# EAGLE design femtoduinoUSB (EAGLE 6.4)
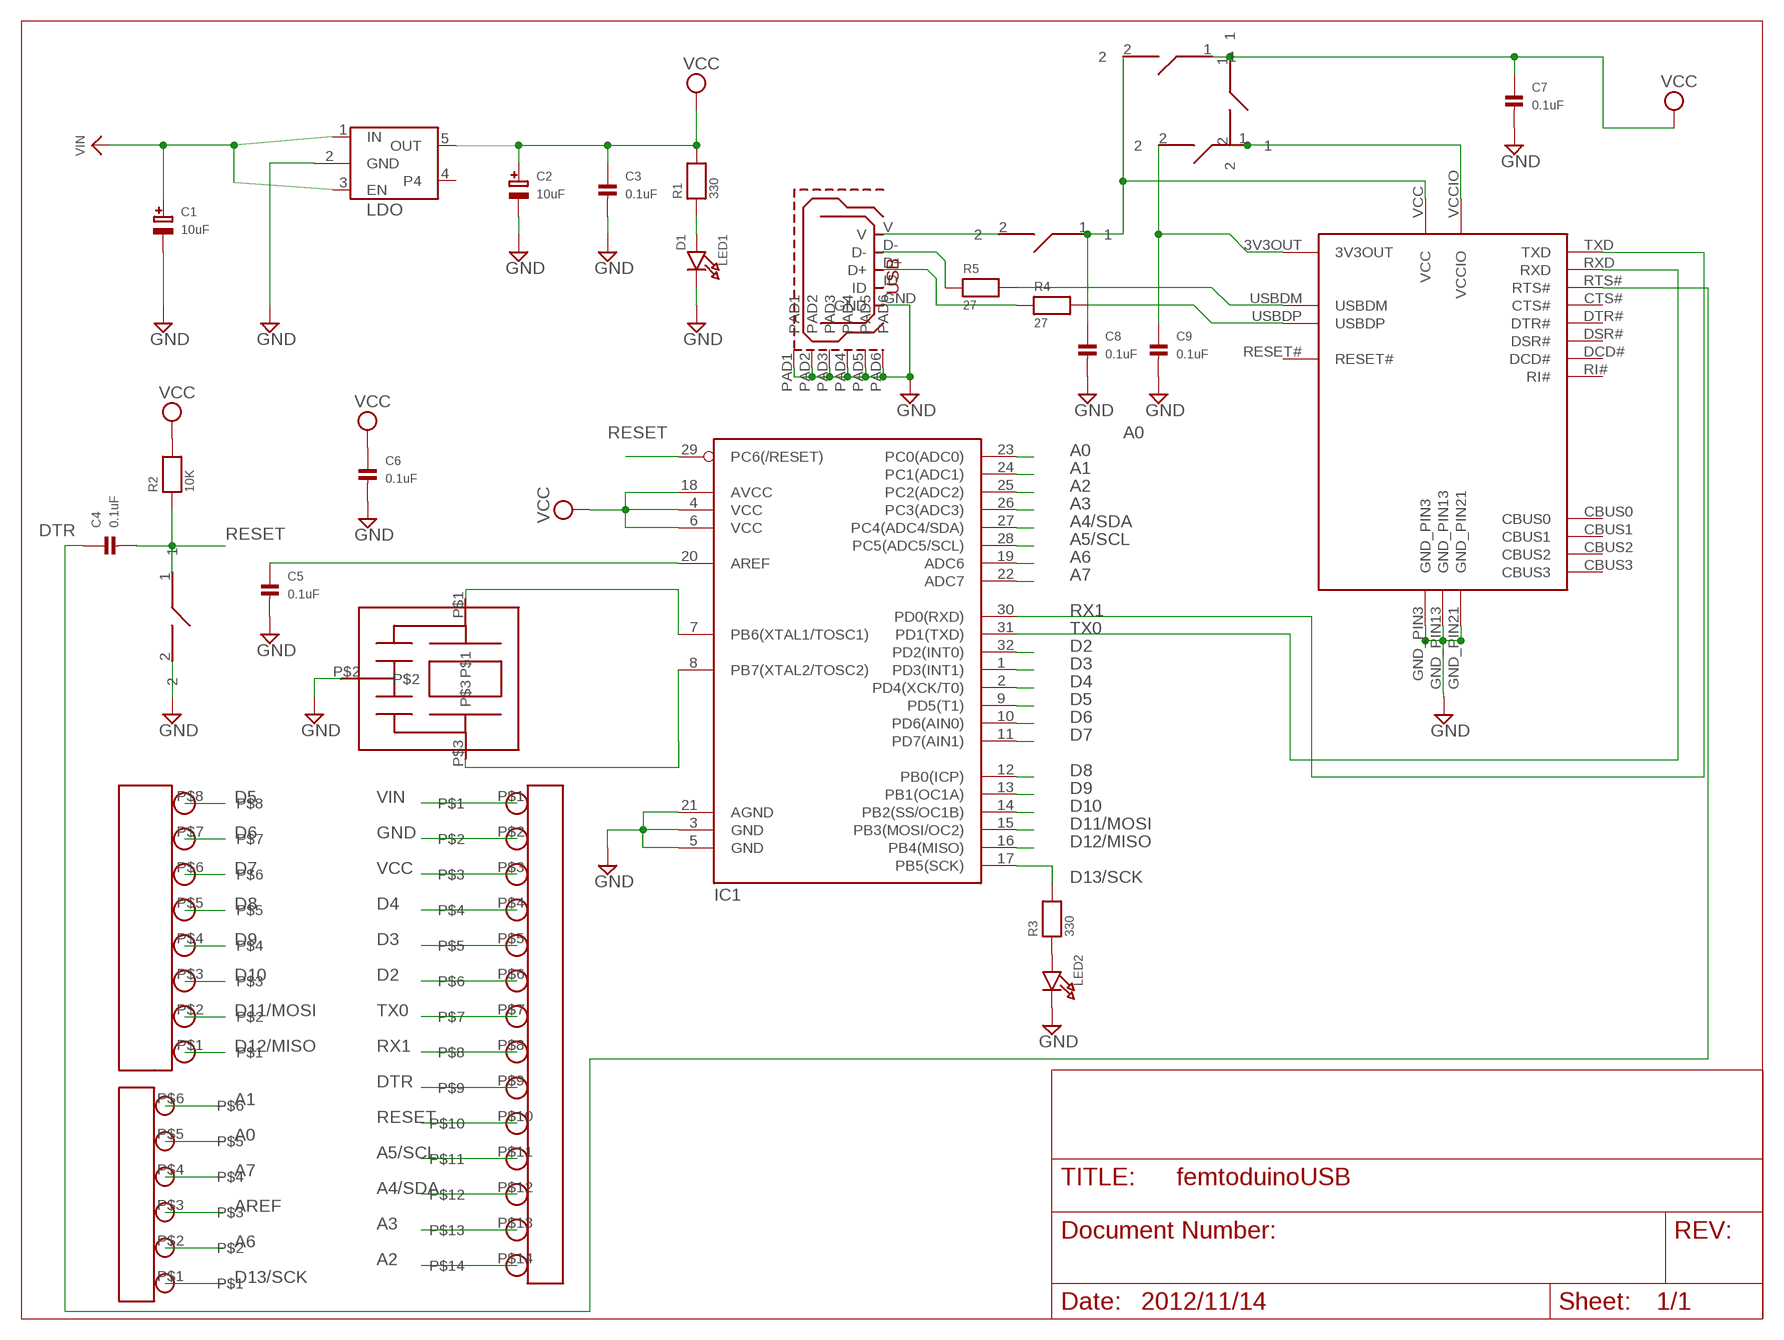
[diagram p0: schematic, sheet 1]
FRAME1 (LETTER_L): LAST_DATE_TIME: 2012/11/14

## Parts
C1  10uF  CAP_TANTALUMB/3528_WAVE  [EIA3528-21/B-W]
C2  10uF  CAP_TANTALUMB/3528_WAVE  [EIA3528-21/B-W]
C3  0.1uF  CAP_CERAMIC0402  [0402]
C4  0.1uF  CAP_CERAMIC0402  [0402]
C5  0.1uF  CAP_CERAMIC0402  [0402]
C6  0.1uF  CAP_CERAMIC0402  [0402]
C7  0.1uF  CAP_CERAMIC0402  [0402]
C8  0.1uF  CAP_CERAMIC0402  [0402]
C9  0.1uF  CAP_CERAMIC0402  [0402]
IC1  ATMEGA168MLF  [MLF32]
IC2  FT231XQ-R  [FTDI_FT231XQ-R_PACKAGE]
LED1  D1  LED0805  [CHIPLED_0805]
LED2  LED0805  [CHIPLED_0805]
R1  330  RESISTOR0402  [0402]
R2  10K  RESISTOR0402  [0402]
R3  330  RESISTOR0402  [0402]
R4  27  RESISTOR0402  [0402]
R5  27  RESISTOR0402  [0402]
SJ1  SPST_SMD  [SPST_SMD]
SJ2  SPST_SMD  [SPST_SMD]
SJ3  SPST_SMD  [SPST_SMD]
SJ4  SPST_SMD  [SPST_SMD]
U1  MIC5205  LDO_REGULATOR  [LDO_REGULATOR]
U$2  05_PINHEAD_1X6  [05_PINHEAD_1X6_PACKAGE]
U$3  05_PINHEAD_1X8  [05_PINHEAD_1X8_PACKAGE]
U$4  05_PINHEAD_1X14  [05_PINHEAD_1X14_PACKAGE]
U$5  CSTCE16MOV51-RO  [CSTCE16M0V51-RO_PACKAGE]
U$6  SPST_SMD  [SPST_SMD]
USB1  USB_MICROB  [USB_MICROB_PACKAGE]

## Nets
A0: IC1.23(PC0(ADC0)) U$2.P$5
A1: IC1.24(PC1(ADC1)) U$2.P$6
A2: IC1.25(PC2(ADC2)) U$4.P$14
A3: IC1.26(PC3(ADC3)) U$4.P$13
A4/SDA: IC1.27(PC4(ADC4/SDA)) U$4.P$12
A5/SCL: IC1.28(PC5(ADC5/SCL)) U$4.P$11
A6: IC1.19(ADC6) U$2.P$2
A7: IC1.22(ADC7) U$2.P$4
AREF: C5.1 IC1.20(AREF) U$2.P$3
D2: IC1.32(PD2(INT0)) U$4.P$6
D3: IC1.1(PD3(INT1)) U$4.P$5
D4: IC1.2(PD4(XCK/T0)) U$4.P$4
D5: IC1.9(PD5(T1)) U$3.P$8
D6: IC1.10(PD6(AIN0)) U$3.P$7
D7: IC1.11(PD7(AIN1)) U$3.P$6
D8: IC1.12(PB0(ICP)) U$3.P$5
D9: IC1.13(PB1(OC1A)) U$3.P$4
D10: IC1.14(PB2(SS/OC1B)) U$3.P$3
D11/MOSI: IC1.15(PB3(MOSI/OC2)) U$3.P$2
D12/MISO: IC1.16(PB4(MISO)) U$3.P$1
D13/SCK: IC1.17(PB5(SCK)) R3.2 U$2.P$1
DTR: C4.1 IC2.RTS# U$4.P$9
GND: C1.- C2.- C3.2 C5.2 C6.2 C7.2 C8.2 C9.2 IC1.3(GND) IC1.5(GND) IC1.21(AGND) IC2.GND_PIN3 IC2.GND_PIN13 IC2.GND_PIN21 LED1.C LED2.C U1.2(GND) U$4.P$2 U$5.P$2 U$6.2 USB1.GND USB1.PAD1 USB1.PAD2 USB1.PAD3 USB1.PAD4 USB1.PAD5 USB1.PAD6
N$1: R4.1 USB1.D+
N$2: R5.1 USB1.D-
N$4: C8.1 IC2.VCC SJ1.1 SJ2.2
N$5: LED1.A R1.1
N$6: IC2.USBDM R5.2
N$7: IC2.USBDP R4.2
N$8: C9.1 IC2.3V3OUT SJ4.2
N$9: IC2.VCCIO SJ3.2 SJ4.1
N$25: LED2.A R3.1
PB6: IC1.7(PB6(XTAL1/TOSC1)) U$5.P$1
PB7: IC1.8(PB7(XTAL2/TOSC2)) U$5.P$3
RESET: C4.2 IC1.29(PC6(/RESET)) R2.1 U$4.P$10 U$6.1
RX1: IC1.30(PD0(RXD)) IC2.TXD U$4.P$8
TX0: IC1.31(PD1(TXD)) IC2.RXD U$4.P$7
VCC: C2.+ C3.1 C6.1 C7.1 IC1.4(VCC) IC1.6(VCC) IC1.18(AVCC) R1.2 R2.2 SJ1.2 SJ2.1 SJ3.1 U1.5(OUT) U$4.P$3 USB1.V
VIN: C1.+ U1.1(IN) U1.3(EN) U$4.P$1
Unconnected: IC2.CBUS0 IC2.CBUS1 IC2.CBUS2 IC2.CBUS3 IC2.CTS# IC2.DCD# IC2.DSR# IC2.DTR# IC2.RESET# IC2.RI# U1.4 USB1.ID

## Library data of the parts
C1 C2 = microbuilder:CAP_TANTALUM: Tantalum Capacitors Wave footprints have larger pads and are meant to be used for hand soldering. Reflow footprints are optimised for solder paste and a reflow oven. EIA3216-18/A-[R/W] - Size A / 3216-18 / 1206 footprint 4.7µF 25V 10% Tantalum Capacitor 10µF 16V 10% Tantalum Capacitor [Digikey: 495-2236-2-ND] EIA3528-21/B-[R/W] - Size B / 3528-21 47µF 10V 10% Tantalum Capactior [Digikey: 495-2216-1-ND] EIA6032-28/C-[R/W] - Size C / 6032-28 10µF 35V 20% Tantalum Capacitor [Digikey: 495-2285-1-ND] 100µF 16V 10% Tantalum Capactior [Digikey: 399-5214-1-ND]
C3-C9 = microbuilder:CAP_CERAMIC: Ceramic Capacitors 0402 - 0402 Surface Mount Capacitors 16pF 50V 5% [Digikey: 445-4899-2-ND] 18pF 50V 5% [Digikey: 490-1281-2-ND] 22pF 50V 5% [Digikey: 490-1283-2-ND] 68pF 50V 5% [Digikey: 490-1289-2-ND] 0.1uF 10V 10% [Digikey: 490-1318-2-ND] 1.0uF 6.3V 10% [Digikey: 490-1320-2-ND] 0603 - 0603 Surface Mount Capacitors 16 pF 50V 5% [Digikey: 445-5051-2-ND] 22 pF 50V [Digikey: PCC220ACVTR-ND] 33 pF 50V 5% [Digikey: 490-1415-1-ND] 56pF 50V 5% [Digikey: 490-1421-1-ND] 220pF 50V 5% [Digikey: 445-1285-1-ND] 680 pF 50V 2200 pF 50V 5% C0G [Digikey: 445-1297-1-ND] 5600 pF 100V 5% X7R [Digikey: 478-3711-1-ND] 0.1 µF 25V 10% [Digikey: PCC2277TR-ND] 0.22 µF 16V 10% X7R [Digikey: 445-1318-1-ND] 1.0 µF 25V 10% [Digikey: 445-5146-2-ND] 0603 - RF Specific 3pF 250V +/-0.1pF RF [Digikey: 712-1347-1-ND] 18 pF 250V 5% [Digikey: 478-3505-1-ND or 712-1322-1-ND] 56 pF 250V 5% C0G RF [Digikey: 490-4867-1-ND] 68 pF 250V RF [Digikey: 490-4868-1-ND] 0805 - 0805 Surface Mount Capacitors 220 pF 250V 2% RF Ceramic Capacitor [Digikey: 712-1398-1-ND] 1000 pF 50V 2% NP0 Ceramic Capacitor [Digikey: 478-3760-1-ND] 0.1 µF 25V 10% Ceramic Capacitor [Digikey: PCC1828TR-ND] 1.0 µF 16V 10% Ceramic Capacitor[Digikey: 490-1691-2-ND] 10.0 µF 10V 10% Ceramic Capacitor[Digikey: 709-1228-1-ND] 10.0 uF 16V 10% Ceramic Capacitor [Digikey: 478-5165-2-ND] 47 uF 6.3V 20% Ceramic Capacitor [Digikey: 587-1779-1-ND or 399-5506-1-ND] 1206 - 1206 Surface Mount Capacitors 47uF 10V 20% Ceramic Capacitor [Digikey: 490-5528-1-ND or 399-5508-1-ND or 445-6010-1-ND] 100uF 6.3V -20%, +80% Y5V Ceramic Capacitor (Digikey: 490-4512-1-ND, Mouser: 81-GRM31CF50J107ZE1L)
IC1 = SparkFun-DigitalIC:ATMEGA168: Atmel 32-pin 8-bit micro, 16k flash.
IC2 = ftdi_ft231xq-r:FT231XQ-R: This is the 20-LD QFN package of the FTDI FT231XQ-R chip.
LED1 LED2 = microbuilder:LED: LED 0603 - 0603 Surface Mount Package 2mA: Green LED - Low Power (3.9mcd, 2ma, 1.7Vf) - Digikey: 475-2709-2-ND Orange LED - Low Power (9.8mcd, 2ma, 1.8Vf) - Digikey: 475-1194-2-ND Red LED - Low Power (5mcd, 2ma, 1.8Vf) - Digikey: 475-1195-2-ND Yellow LED - Low Power (7mcd, 2ma, 1.8Vf) - Digikey: 475-1196-2-ND 5mA: Blue LED - Low Power (17mcd, 5ma, 2.9Vf) - Digikey: LNJ937W8CRACT-ND 0805 - 0805 Surface Mount Package 2mA: Red LED (8.8mcd, 2mA, 1.8Vf, Clear) - Low Power [Digikey: 475-2510-1-ND] Green LED (5mcd, 2mA, 1.8Vf, Clear) - Low Power [Digikey: 475-2730-1-ND] Yellow LED (11.3mcd, 2mA, 1.8Vf, Clear) - Low Power [Digikey: 475-2555-1-ND] 20mA: Red LED (104mcd, 20mA, Diffused) - LS R976 [Digikey: 475-1278-6-ND] Red LED (12mcd, 20mA, 2.0Vf, Clear) - APT2012EC [Digikey: 754-1128-1-ND] Green LED (15mcd, 20mA, 2.2Vf, Clear) - APT2012GC [Digikey: 754-1131-1-ND] Orange LED (160mcd, 20mA, 2.1Vf, Clear) - APT2012SECK [Digikey: 754-1130-1-ND] 1206 - 1206 Surface Mount Package Green LED (26mcd, 20mA, Diffused) - LG N971 [Digikey: 475-1407-6-ND] Red LED (15mcd, 20mA, Diffused) - LH N974 [Digikey: 475-1416-6-ND]
R1-R5 = microbuilder:RESISTOR: Resistors 0402 - 0402 Surface Mount Package 22 Ohm 1% 1/16W [Digikey: 311-22.0LRTR-ND] 33 Ohm 5% 1/16W 1.0K 5% 1/16W 1.5K 5% 1/16W 2.0K 1% 1/16W 10.0K 1% 1/16W [Digikey: 311-10.0KLRTR-ND] 10.0K 5% 1/16W [Digikey: RMCF0402JT10K0TR-ND] 12.1K 1% 1/16W [Digikey: 311-22.0LRTR-ND] 100.0K 5% 1/16W 0603 - 0603 Surface Mount Package 0 Ohm 1/10 Watt 1% Resistor 15 Ohm 1/10 Watt 1% Resistor 33 Ohm 1/10 Watt 1% Resistor 49.9 Ohm 1/10 Watt 1% Resistor 100 Ohm 1/10 Watt 1% Resistor 150 Ohm 1/10 Watt 1% Resistor 240 Ohm 1/10 Watt 1% Resistor 390 Ohm 1/10 Watt 1% Resistor 560 Ohm 1/10 Watt 1% Resistor 680 Ohm 1/10 Watt 1% Resistor 750 Ohm 1/10 Watt 1% Resistor 1.0K Ohm 1/10 Watt 1% Resistor 1.5K Ohm 1/10 Watt 1% Resistor 2.0K Ohm 1/10 Watt 1% Resistor 2.2K Ohm 1/10 Watt 1% Resistor 3.3K Ohm 1/10 Watt 1% Resistor 4.7K Ohm 1/10 Watt 1% Resistor 10.0K Ohm 1/10 Watt 1% Resistor 12.0K Ohm 1/10 Watt 1% Resistor 12.1K Ohm 1/10 Watt 1% Resistor 20.0K Ohm 1/10 Watt 1% Resistor 33.0K Ohm 1/10 Watt 1% Resistor 100.0K Ohm 1/10 Watt 1% Resistor 0805 - 0805 Surface Mount Package 0 Ohm 1/8 Watt 1% Resistor 33 Ohm 1/8 Watt 1% Resistor 100 Ohm 1/8 Watt 1% Resistor 150 Ohm 1/8 Watt 1% Resistor 200 Ohm 1/8 Watt 1% Resistor 240 Ohm 1/8 Watt 1% Resistor 330 Ohm 1/8 Watt 1% Resistor 390 Ohm 1/8 Watt 1% Resistor 470 Ohm 1/8 Watt 1% Resistor 1.0K Ohm 1/8 Watt 1% Resistor 1.5K Ohm 1/8 Watt 1% Resistor 2.0K Ohm 1/8 Watt 1% Resistor 4.7K Ohm 1/8 Watt 1% Resistor 5.1K Ohm 1/8 Watt 1% Resistor 5.6K Ohm 1/8 Watt 1% Resistor 10.0K Ohm 1/8 Watt 1% Resistor 22.0K Ohm 1/8 Watt 1% Resistor 33.0K Ohm 1/8 Watt 1% Resistor 100K Ohm 1/8 Watt 1% Resistor 1206 - 1206 Surface Mount Package 2012 - 2010 Surface Mount Package 0.11 Ohm 1/2 Watt 1% Resistor - Digikey: RHM.11UCT-ND
SJ1-SJ4 U$6 = ftdi_ft231xq-r:SPST_SMD
U1 = ftdi_ft231xq-r:LDO_REGULATOR
U$2 = ftdi_ft231xq-r:05_PINHEAD_1X6
U$3 = ftdi_ft231xq-r:05_PINHEAD_1X8
U$4 = ftdi_ft231xq-r:05_PINHEAD_1X14
U$5 = ftdi_ft231xq-r:CSTCE16MOV51-RO: This is the CSTCE16M0V51-R0 Murata resonator (CERALOCK) 16Mhz 0.5% Tolerance
USB1 = ftdi_ft231xq-r:USB_MICROB: This is the hirose ZX62-B-5PA(11) MICRO-USB B Type female connection.

## Board
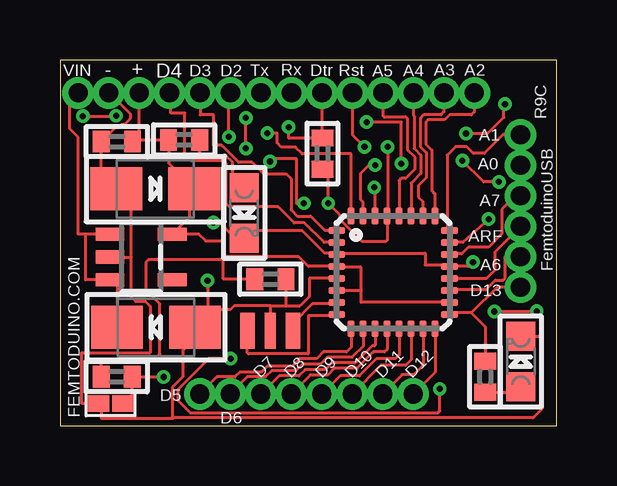
[diagram p1: board, top side]
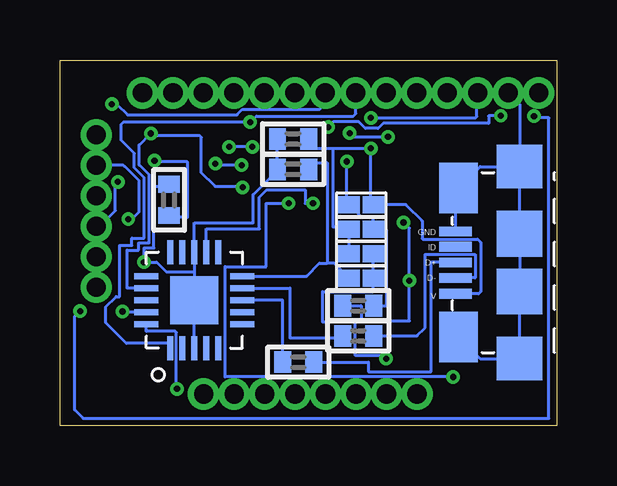
[diagram p2: board, bottom side, seen from below]

Size 20.7 x 15.24 mm. Coordinates in mm from the lower left corner, seen from the top.
Outline: 0,0 20.7,0 20.7,15.24 0,15.24 0,0
Copper layers (1*16): Top 0.035mm / dielectric 1.5mm / Bottom 0.035mm
Design rules "Fusion_eagle_rule_v1.1": minimum track width 6mil, minimum drill 12mil, track to track 6mil, track to pad 6mil, pad to pad 6mil, via to via 6mil, smd to smd 0mil, copper to edge 10mil, drill to drill 10mil, minimum pad ring 10mil, minimum via ring 6mil, stop-mask expansion 2mil, vias tented up to drill 100mil, thermal gap 10mil

### Footprints (pad centres in the part's own frame; a part is rotated, then mirrored left to right if it is on the bottom)
EIA3528-21/B-W = smd 2.15 x 1.8: + 1.625,0; - -1.625,0
0402 = smd 0.7 x 0.9: 1 -0.65,0; 2 0.65,0
MLF32 = smd 0.7 x 0.3: 1 -2.35,1.75; 2 -2.35,1.25; 3 -2.35,0.75; 4 -2.35,0.25; 5 -2.35,-0.25; 6 -2.35,-0.75; 7 -2.35,-1.25; 8 -2.35,-1.75; 17 2.35,-1.75; 18 2.35,-1.25; 19 2.35,-0.75; 20 2.35,-0.25; 21 2.35,0.25; 22 2.35,0.75; 23 2.35,1.25; 24 2.35,1.75 | smd 0.3 x 0.7: 9 -1.75,-2.35; 10 -1.25,-2.35; 11 -0.75,-2.35; 12 -0.25,-2.35; 13 0.25,-2.35; 14 0.75,-2.35; 15 1.25,-2.35; 16 1.75,-2.35; 25 1.75,2.35; 26 1.25,2.35; 27 0.75,2.35; 28 0.25,2.35; 29 -0.25,2.35; 30 -0.75,2.35; 31 -1.25,2.35; 32 -1.75,2.35
FTDI_FT231XQ-R_PACKAGE = smd 0.25 x 1: 3V3OUT 0.968,-2.032; CBUS2 -0.532,-2.032; CBUS3 0.968,1.968; CTS# -1.032,-2.032; DTR# -0.032,1.968; RTS# -0.532,1.968; TXD 0.468,1.968; USBDM 0.468,-2.032; USBDP -0.032,-2.032; VCCIO -1.032,1.968 | smd 1 x 0.25: CBUS0 1.968,0.968; CBUS1 1.968,0.468; DCD# -2.032,-1.032; DSR# -2.032,-0.532; GND_PIN3 -2.032,-0.032; GND_PIN13 1.968,-0.032; RESET# 1.968,-1.032; RI# -2.032,0.468; RXD -2.032,0.968; VCC 1.968,-0.532 | smd 2 x 2: GND_PIN21 -0.032,-0.032
CHIPLED_0805 = smd 1.2 x 1.2: A 0,-1.05; C 0,1.05
SPST_SMD = smd 0.889 x 0.699: 1 -0.508,0; 2 0.508,0
LDO_REGULATOR = smd 0.55 x 1.2: 1 -0.95,-1.3; 2 0,-1.3; 3 0.95,-1.3; 4 0.95,1.3; 5 -0.95,1.3
05_PINHEAD_1X6_PACKAGE = drill 0.8 pad 1.143: P$1 0,0; P$2 0,1.27; P$3 0,2.54; P$4 0,3.81; P$5 0,5.08; P$6 0,6.35
05_PINHEAD_1X8_PACKAGE = drill 0.8 pad 1.143: P$1 0,0; P$2 0,1.27; P$3 0,2.54; P$4 0,3.81; P$5 0,5.08; P$6 0,6.35; P$7 0,7.62; P$8 0,8.89
05_PINHEAD_1X14_PACKAGE = drill 0.8 pad 1.143: P$1 0,0; P$2 0,1.27; P$3 0,2.54; P$4 0,3.81; P$5 0,5.08; P$6 0,6.35; P$7 0,7.62; P$8 0,8.89; P$9 0,10.16; P$10 0,11.43; P$11 0,12.7; P$12 0,13.97; P$13 0,15.24; P$14 0,16.51
CSTCE16M0V51-RO_PACKAGE = smd 1.5 x 0.62: P$1 0,1.9; P$3 0,0 | smd 1.5 x 0.45: P$2 0,0.95
USB_MICROB_PACKAGE = smd 0.4 x 1.35: D+ 0,-0.68; D- -0.64,-0.68; GND 1.3,-0.68; ID 0.66,-0.68; V -1.3,-0.68 | smd 2.1 x 1.6: PAD1 -3.1,-0.8; PAD2 3.1,-0.8 | smd 1.8 x 1.9: PAD3 -4,-3.35; PAD6 4,-3.35 | smd 1.9 x 1.9: PAD4 -1.2,-3.35; PAD5 1.2,-3.35

### Placement (x,y rotation side)
C1  4,4.1 180 top
C2  3.97,9.87 0 top
C3  2.37,11.84 180 top
C4  10.93,11.34 270 top
C5  16.16,9.41 90 bottom
C6  8.77,6.11 0 top
C7  10.99,11.95 180 bottom
C8  8.27,5 180 bottom
C9  10.99,10.68 180 bottom
IC1  13.88,6.39 0 top
IC2  15.13,5.27 90 bottom
LED1  7.67,8.87 180 top
LED2  19.2,2.68 0 top
R1  5.17,11.91 180 top
R2  2.36,2.04 180 top
R3  17.72,2.04 90 top
R4  10.77,2.65 180 bottom
R5  8.27,3.74 180 bottom
SJ1  8.15,9.21 0 bottom
SJ2  8.15,8.19 0 bottom
SJ3  8.15,7.17 0 bottom
SJ4  8.15,6.15 180 bottom
U1  3.38,7.03 270 top
U$2  19.19,5.77 0 top
U$3  14.72,1.32 90 top
U$4  0.76,13.87 270 top
U$5  7.81,3.97 270 top
U$6  2.11,0.92 180 top
USB1  4.9,6.8 90 bottom

### Tracks (layer width: path | path; a pad name or v marks a point on that pad's centre or on a via)
A0  (via drill 0.25 pad 0.13)
  Top 0.127: v17.86,8.61 16.79,7.64 IC1.23
  Bottom 0.127: v17.86,8.61 17.7,8.61 17.4,8.91 17.4,10.21 17.98,10.79 18.01,10.79 18.06,10.85 U$2.P$5
A1
  Top 0.127: U$2.P$6 18.45,12.12 17.68,11.35 17.22,11.35 16.94,11.63 16.48,11.63 16.13,11.28 16.13,8.24 IC1.24
A2
  Top 0.127: U$4.P$14 17.27,13.07 17.14,12.95 16.23,12.95 16.03,12.75 15.34,12.75 15.24,12.65 15.24,11.73 15.49,11.48 15.49,9.8 15.62,9.68 IC1.25
A3
  Top 0.127: U$4.P$13 16,13.07 15.88,12.95 15.16,12.95 15.01,12.8 15.01,11.63 15.27,11.38 15.27,10.34 14.94,10.01 14.94,9.53 15.11,9.35 15.11,8.76 IC1.26
A4/SDA
  Top 0.127: U$4.P$12 14.73,12.94 14.76,12.9 14.76,11.56 15.04,11.28 15.04,10.52 14.63,10.11 IC1.27
A5/SCL
  Top 0.127: U$4.P$11 13.46,12.91 13.49,12.88 14.4,12.88 14.48,12.8 14.48,11.51 14.78,11.2 14.78,10.69 14.4,10.31 14.22,10.31 14.13,10.22 IC1.28
A6
  Top 0.127: U$2.P$2 18.55,7.04 18.54,7.04 18.54,6.15 18.47,6.07 18.14,6.07 17.73,5.66 16.25,5.66 IC1.19
A7
  Top 0.127: U$2.P$4 18.98,9.58 18.41,9.02 18.41,8 17.86,7.44 17.02,7.44 16.74,7.16 16.25,7.16 IC1.22
AREF  (via drill 0.25 pad 0.13)
  Top 0.127: v18.29,10.16 17.65,10.16 v16.76,11.05 | IC1.20 17.78,6.14 18.14,6.5 18.14,7.26 U$2.P$3
  Bottom 0.127: v16.76,11.05 16.76,11 15.39,11 15.39,8.69 16.16,8.69 C5.1 | U$2.P$3 19.05,8.31 18.39,8.97 18.39,10.06 v18.29,10.16
D2  (via drill 0.25 pad 0.13)
  Top 0.127: IC1.32 12.13,11.33 10.08,11.33 9.8,11.61 9.22,11.61 9.04,11.79 9.04,12.19 v8.64,12.19 | v7.04,12.04 7.04,13.8 U$4.P$6
  Bottom 0.127: v8.64,12.19 8.48,12.04 v7.04,12.04
D3
  Top 0.127: U$4.P$5 5.84,12.95 6.4,12.95 6.4,11.68 6.73,11.68 7.44,10.97 8,10.97 8.48,10.49 9.42,10.49 9.63,10.29 9.63,8.99 9.88,8.74 10.44,8.74 11.04,8.14 IC1.1
D4
  Top 0.127: IC1.2 11,7.64 10.19,8.46 9.75,8.46 9.09,9.12 7.06,9.12 6.93,9.25 6.93,10.9 6.78,11.05 5.46,11.05 5.21,11.3 5.21,13.03 4.62,13.03 4.62,13.87 U$4.P$4
D5
  Top 0.127: IC1.9 12.13,3.27 11.94,3.07 10.97,3.07 10.69,2.79 9.98,2.79 9.68,2.49 8.64,2.49 8.38,2.23 7.49,2.23 7.29,2.03 6.54,2.03 U$3.P$8
D6
  Top 0.127: IC1.10 12.63,3.31 12.17,2.85 11.12,2.85 10.85,2.56 10.11,2.56 9.83,2.29 8.81,2.29 8.56,2.03 7.81,2.03 U$3.P$7
D7
  Top 0.127: IC1.11 13.13,3.35 13.11,3.33 13.01,3.33 12.29,2.62 11.33,2.62 11.05,2.34 10.21,2.34 9.96,2.08 9.13,2.08 U$3.P$6
D8
  Top 0.127: IC1.12 13.63,3.19 13.51,3.07 13.06,3.07 12.37,2.39 11.43,2.39 11.15,2.11 10.42,2.11 U$3.P$5
D9
  Top 0.127: IC1.13 14.13,2.95 13.97,2.79 13.18,2.79 12.47,2.08 11.67,2.08 U$3.P$4
D10
  Top 0.127: IC1.14 14.63,2.74 14.4,2.52 13.37,2.52 U$3.P$3
D11/MOSI
  Top 0.127: IC1.15 15.13,2.53 14.73,2.13 14.26,2.13 U$3.P$2
D12/MISO
  Top 0.127: IC1.16 15.63,2.23 U$3.P$1
D13/SCK
  Top 0.127: U$2.P$1 18.22,5.77 17.14,4.7 | 17.14,4.7 16.29,4.7 IC1.17 | 17.14,4.7 17.72,4.13 R3.2
DTR  (via drill 0.25 pad 0.13)
  Top 0.127: U$4.P$9 10.93,13.87 C4.1 9.53,11.99 v9.53,12.45 | v0.95,12.9 2.34,12.9 v2.34,12.92 | v18.1,4.76 19.85,4.76 v19.86,4.78
  Bottom 0.127: IC2.RTS# 18.1,4.74 v18.1,4.76 | v0.95,12.9 0.95,12.83 0.33,12.83 0.33,0.3 19.74,0.3 20.09,0.66 20.09,4.55 v19.86,4.78 | v2.34,12.92 2.85,12.92 2.85,12.6 7.24,12.6 7.44,12.39 7.98,12.39 8.26,12.68 9.3,12.68 v9.53,12.45
GND  (via drill 0.25 pad 0.13)
  Top 0.127: 19.23,4 LED2.C 20.09,3.73 20.09,0.71 19.71,0.33 4.7,0.33 | C3.2 1.72,9.87 C2.- 2.35,9.47 2.97,9.47 2.97,7.03 | U1.2 2.97,7.03 | C1.- 6.15,4.1 6.15,5.71 v6.15,6.04 | 11.53,7.19 IC1.3 | v17.21,6.82 17.21,6.64 IC1.21 16.23,6.71 15.21,6.71 15.21,7.19 11.53,7.19 | 2.97,7.03 2.97,5.36 3.15,5.18 3.56,5.18 3.76,4.98 3.76,3.05 0.91,3.05 0.91,0.93 U$6.2 1.73,0.93 1.73,0.3 4.7,0.3 4.7,0.33 | 11.53,7.19 11.02,7.19 10.08,8.13 7.98,8.13 LED1.C 7.29,7.82 6.64,8.47 v6.39,8.47 | 11.53,6.2 IC1.5 10.39,6.14 10.39,5.38 10.01,5 9.45,5 | C1.- 5.62,3.64 5.13,3.15 5.13,2.06 4.7,1.63 4.7,0.33 | 8.76,5 U$5.P$2 | C1.- 6.38,4.85 7.11,4.85 7.26,5 8.76,5 | 8.76,5 9.45,5 | C6.2 9.42,5.03 9.45,5 | U$4.P$2 2.46,13.44 2.49,13.44 2.92,13.01 2.92,12.8 2.67,12.55 2.56,12.55 2.49,12.47 2.36,12.47 C3.2 | 1.8,11.91 C3.2
  Bottom 0.127: U$4.P$2 1.55,13.39 USB1.PAD6 | USB1.PAD6 USB1.PAD5 USB1.PAD4 USB1.PAD3 3.2,2.8 USB1.PAD1 | USB1.PAD6 3.2,10.8 USB1.PAD2 4.22,9.9 USB1.GND | C9.2 C7.2 | 15.1,6.43 IC2.GND_PIN13 15.1,8.46 12.65,8.46 12.65,9.63 11.64,10.64 C9.2 | IC2.GND_PIN3 IC2.GND_PIN21 15.1,6.43 | 11.92,10.68 C9.2 | C5.2 16.16,9.98 16.79,9.98 16.79,7.42 17.21,7.42 v17.21,6.82 16.68,6.82 16.28,6.43 15.1,6.43 | 6.41,8.47 v6.39,8.47 6.15,8.23 v6.15,6.04 6.15,4.37 8.15,4.37 8.15,5 C8.2
N$1
  Bottom 0.127: USB1.D+ 5.23,6.81 5.23,2.26 7.85,2.26 7.85,2.65 R4.1
N$2
  Bottom 0.127: R5.1 5.83,3.74 5.49,4.09 5.49,7.14 3.4,7.14 3.4,6.16 USB1.D-
N$4  (via drill 0.25 pad 0.13)
  Top 0.127: v10.16,9.27 9.86,9.27 9.86,11.12 8.75,11.12 v8.75,11.01
  Bottom 0.127: SJ1.1 8.13,8.69 7.67,8.69 7.64,8.66 SJ2.2 7.64,8.15 7.09,8.15 7.09,5 C8.1 | 8.83,9.21 SJ1.1 | SJ1.1 8.75,9.21 v8.75,11.01 | v10.16,9.27 10.49,9.27 10.49,9.83 12.09,9.83 12.39,9.53 12.39,8.2 14.6,8.2 IC2.VCC
N$5
  Top 0.127: LED1.A 7.19,10.4 7.19,10.97 6.91,11.25 5.82,11.25 R1.1
N$6
  Bottom 0.127: IC2.USBDM 11.12,5.74 11.12,3.66 8.92,3.66 R5.2
N$7
  Bottom 0.127: R4.2 11.42,5.24 IC2.USBDP
N$8
  Bottom 0.127: C9.1 10.24,10.96 9.58,10.96 9.58,6.77 | IC2.3V3OUT 10.42,6.24 9.89,6.77 9.58,6.77 | SJ4.2 9.28,6.77 9.58,6.77
N$9  (via drill 0.25 pad 0.13)
  Top 0.127: v7.11,2.79 6.2,2.79 4.9,1.5 4.9,1.07 5.44,0.53 15.75,0.53 15.82,0.61 v15.82,1.54
  Bottom 0.127: SJ3.2 SJ4.1 7.64,5.59 9.75,5.59 9.75,4.32 8.41,4.32 8.41,2.95 7.11,2.95 v7.11,2.79 | v15.82,1.54 15.85,1.56 15.85,3.89 15.9,3.94 17.1,3.94 IC2.VCCIO
N$25
  Top 0.127: 18.84,1.57 LED2.A 19.2,1.39 R3.1
PB6
  Top 0.127: 9.93,3.97 U$5.P$1 9.71,4.28 10.52,5.08 11.53,5.08 IC1.7
PB7
  Top 0.127: IC1.8 11.53,4.6 10.36,4.6 10.36,3.02 10.34,3 7.85,3 7.81,3.04 U$5.P$3
RESET  (via drill 0.25 pad 0.13)
  Top 0.127: U$6.1 3.01,1.32 R2.1 3.02,2.03 v4.32,2.03 | C4.2 11.18,10.69 v11.18,9.27 11.68,8.76 11.68,8.59 12.6,7.67 13.56,7.67 13.63,7.74 IC1.29 13.65,8.77 v13.65,11.62 | U$4.P$10 12.19,12.12 v12.69,11.62
  Bottom 0.127: v11.18,9.27 12.12,9.27 12.12,6.63 13.82,6.63 13.82,2.03 v4.32,2.03 | v12.69,11.62 v13.65,11.62
RX1  (via drill 0.25, 0.25 pad 0.13)
  Top 0.127: IC1.30 13.13,9.76 v13.09,9.93 | v16.92,12.18 17.82,12.18 18.49,12.85 18.49,13.35 v18.54,13.4
  Bottom 0.127: IC2.TXD 17.91,5.74 17.91,7.32 17.42,7.32 17.42,7.62 16.99,7.62 16.99,10.46 17.4,10.87 17.4,11.7 v16.92,12.18 16.83,12.09 14.88,12.09 14.81,12.01 14.81,10.54 14.24,9.97 13.13,9.97 v13.09,9.93 | v18.54,13.4 18.33,13.4 17.88,12.95 13.34,12.95 13.11,13.18 9.88,13.18 9.65,13.42 U$4.P$8
TX0  (via drill 0.25 pad 0.13)
  Top 0.127: v14.22,10.92 14.22,12.65 v12.78,12.65 | IC1.31 12.63,9.32 12.52,9.42 12.52,10.52 12.87,10.86 v13.13,10.86
  Bottom 0.127: U$4.P$7 8.38,13.01 8.48,12.9 12.52,12.9 v12.78,12.65 18.06,12.65 18.16,12.55 18.16,11.91 17.6,11.35 17.6,10.74 17.2,10.34 17.2,7.82 17.7,7.82 17.7,7.52 18.21,7.52 18.21,5.38 18.36,5.38 18.8,4.95 18.8,4.29 17.93,3.43 16.1,3.43 IC2.RXD | v13.13,10.86 14.16,10.86 v14.22,10.92
VCC  (via drill 0.25)
  Top 0.127: v7.75,11.56 v7.75,12.83 | 4.75,11.91 R1.2 | 6.81,6.91 3.68,6.91 3.58,6.81 3.58,5.66 4.17,5.08 4.17,3 3.91,2.74 1.8,2.74 1.71,2.65 R2.2 | IC1.6 12.55,5.64 | 12.55,5.64 12.55,6.6 11.53,6.6 IC1.4 10.35,6.64 9.96,7.04 6.81,7.04 | IC1.18 12.55,5.14 12.55,5.64 | C6.1 6.81,6.11 6.81,6.91 | 6.81,7.04 6.81,7.7 6.07,7.7 5.79,7.98 U1.5 5.41,8.71 5.41,9.13 6.15,9.87 C2.+ 4.52,10.94 R1.2 | 6.81,7.04 6.81,6.91 | R1.2 3.1,11.91 C3.1 3.3,12.19 U$4.P$3
  Bottom 0.127: SJ3.1 SJ2.1 8.75,8.28 9.32,8.28 9.32,11.56 | v7.75,12.83 3.38,12.83 3.33,12.88 3.33,13.84 U$4.P$3 | 9.32,11.56 v7.75,11.56 7.75,9.31 SJ1.2 6.29,9.21 5.61,8.53 5.61,7.8 5.59,7.77 3.3,7.77 3.17,7.64 3.17,5.59 3.26,5.5 USB1.V | C7.1 10.34,11.56 9.32,11.56
VIN
  Top 0.127: U1.1 1.07,7.98 | 1.07,7.98 0.76,7.98 0.76,12.02 0.41,12.37 0.41,13.52 U$4.P$1 | C1.+ 2.38,6.08 U1.3 1.07,6.08 1.07,7.98

### Text on the board
tNames: VIN | - | + | D4 | D3 | D2 | Tx | Rx | Dtr | Rst | A5 | A4 | A3 | A2 | R9C | A1 | A0 | A7 | ARF | A6 | FemtoduinoUSB | D13 | D7 | D8 | D9 | D10 | D11 | D12 | D5 | FEMTODUINO.COM | D6